# EAGLE design ATEM GPI-Tally Breakout Board (EAGLE 6.2)
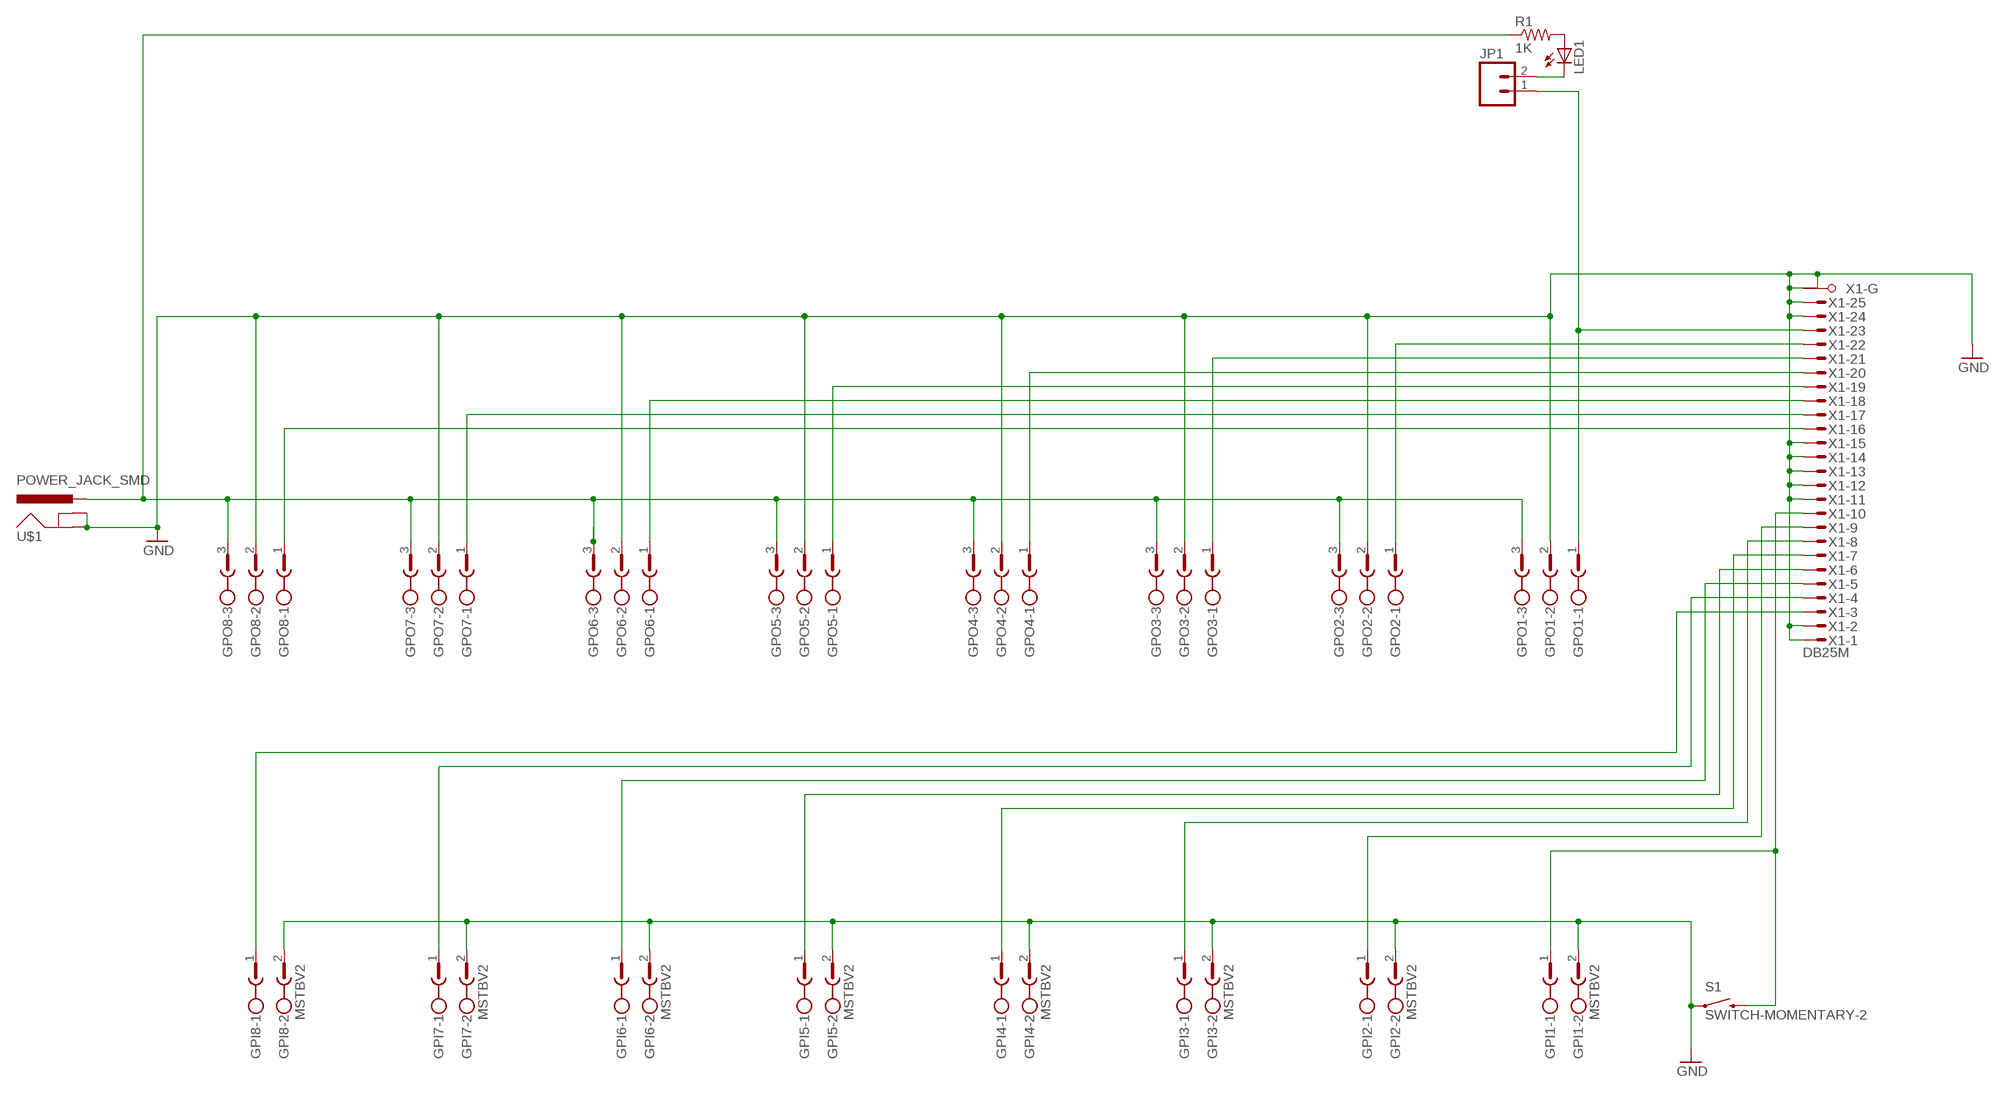
[diagram p0: schematic, sheet 1]

## Parts
GPI1  MSTBV2  [MSTBV2]
GPI2  MSTBV2  [MSTBV2]
GPI3  MSTBV2  [MSTBV2]
GPI4  MSTBV2  [MSTBV2]
GPI5  MSTBV2  [MSTBV2]
GPI6  MSTBV2  [MSTBV2]
GPI7  MSTBV2  [MSTBV2]
GPI8  MSTBV2  [MSTBV2]
GPO1  CON1  MSTBV3  [MSTBV3]
GPO2  CON1  MSTBV3  [MSTBV3]
GPO3  CON1  MSTBV3  [MSTBV3]
GPO4  CON1  MSTBV3  [MSTBV3]
GPO5  CON1  MSTBV3  [MSTBV3]
GPO6  CON1  MSTBV3  [MSTBV3]
GPO7  CON1  MSTBV3  [MSTBV3]
GPO8  CON1  MSTBV3  [MSTBV3]
JP1  M02LOCK  [1X02_LOCK]
LED1  LED5MM  [LED5MM]
R1  1K  RESISTORPTH-1/4W  [AXIAL-0.4]
S1  SWITCH-MOMENTARY-2  [TACTILE_SWITCH_TALL]
U$1  POWER_JACK_SMD  [POWER_JACK_SMD]
X1  DB25M  M25HPS  [M25HP]

## Nets
GND [PWR]: GPI1.2 GPI2.2 GPI3.2 GPI4.2 GPI5.2 GPI6.2 GPI7.2 GPI8.2 GPO1.2 GPO2.2 GPO3.2 GPO4.2 GPO5.2 GPO6.2 GPO7.2 GPO8.2 S1.A2 U$1.GND U$1.SHUNT(GNDBREAK) X1.1(-1:M) X1.2(-2:M) X1.11(-11:M) X1.12(-12:M) X1.13(-13:M) X1.14(-14:M) X1.15(-15:M) X1.24(-24:M) X1.25(-25:M) X1.G1(-G:G1) X1.G2(-G:G2)
N$1 [RELAY LINES]: GPO1.1 JP1.1 X1.23(-23:M)
N$2: JP1.2 LED1.K(C)
N$3: LED1.A R1.P$2
N$6 [RELAY LINES]: GPO2.1 X1.22(-22:M)
N$10 [RELAY LINES]: GPO3.1 X1.21(-21:M)
N$14 [RELAY LINES]: GPO4.1 X1.20(-20:M)
N$18 [RELAY LINES]: GPO5.1 X1.19(-19:M)
N$22 [RELAY LINES]: GPO6.1 X1.18(-18:M)
N$26 [RELAY LINES]: GPO7.1 X1.17(-17:M)
N$30 [RELAY LINES]: GPO8.1 X1.16(-16:M)
N$49 [INput lines]: GPI1.1 S1.B2 X1.10(-10:M)
N$55 [INput lines]: GPI5.1 X1.6(-6:M)
N$60 [INput lines]: GPI2.1 X1.9(-9:M)
N$61 [INput lines]: GPI3.1 X1.8(-8:M)
N$62 [INput lines]: GPI4.1 X1.7(-7:M)
N$64 [INput lines]: GPI6.1 X1.5(-5:M)
N$65 [INput lines]: GPI7.1 X1.4(-4:M)
N$66 [INput lines]: GPI8.1 X1.3(-3:M)
N$75 [RELAY LINES]: GPO1.3 GPO2.3 GPO3.3 GPO4.3 GPO5.3 GPO6.3 GPO7.3 GPO8.3 R1.P$1 U$1.PWR

## Library data of the parts
GPI1-GPI8 = con-phoenix-508:MSTBV2: PHOENIX; MPN: MSTBV 2,5/2-GF-5.08; OC_FARNELL: 1792792; OC_NEWARK: 69R9845
GPO1-GPO8 = con-phoenix-508:MSTBV3: PHOENIX; MPN: MSTBV 2,5/3-GF-5.08; OC_FARNELL: 1792793; OC_NEWARK: 69R9846
JP1 = SparkFun:M02: Header 2 Standard 2-pin 0.1" header. Use with straight break away headers (SKU : PRT-00116), right angle break away headers (PRT-00553), swiss pins (PRT-00743), machine pins (PRT-00117), and female headers (PRT-00115). Molex polarized connector foot print use with SKU : PRT-08233 with associated crimp pins and housings.
LED1 = SparkFun:LED: LEDs Standard schematic elements and footprints for 5mm, 3mm, 1206, and 0603 sized LEDs. 5mm - Spark Fun Electronics SKU : COM-00529 (and others)
R1 = SparkFun:RESISTOR: Resistor Basic schematic elements and footprints for 0603, 1206, and PTH resistors.
S1 = SparkFun:SWITCH-MOMENTARY-2
U$1 = SKAARHOJ:POWER_JACK_SMD: RASM712PX Right Angle SMT Mount DC Power Jack, pin size 0.100"(2.5mm), with locating post Switchcraft.com
X1 = con-subd:M25HPS: SUB-D; OC_FARNELL: unknown; OC_NEWARK: unknown

## Net classes
0 default: width 0.254 mm, drill 0.406 mm, clearance 0.254 mm
1 PWR: width 0.813 mm, drill 0.61 mm, clearance 0.254 mm
2 RELAY LINES: width 0.813 mm, drill 0.61 mm, clearance 0.254 mm
3 INput lines: width 0.254 mm, drill 0.406 mm, clearance 0.254 mm

## Board
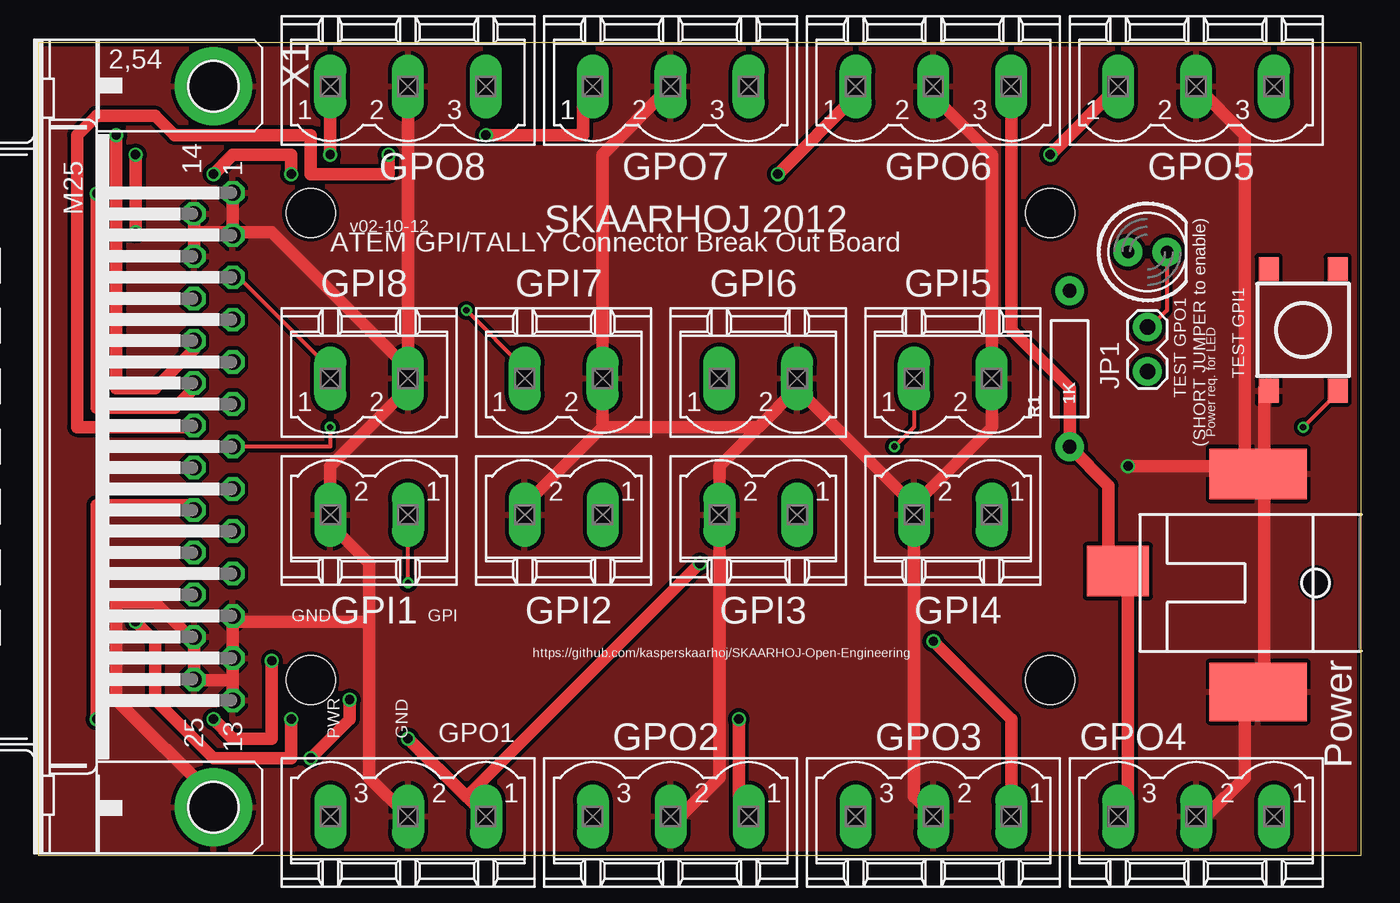
[diagram p1: board, top side]
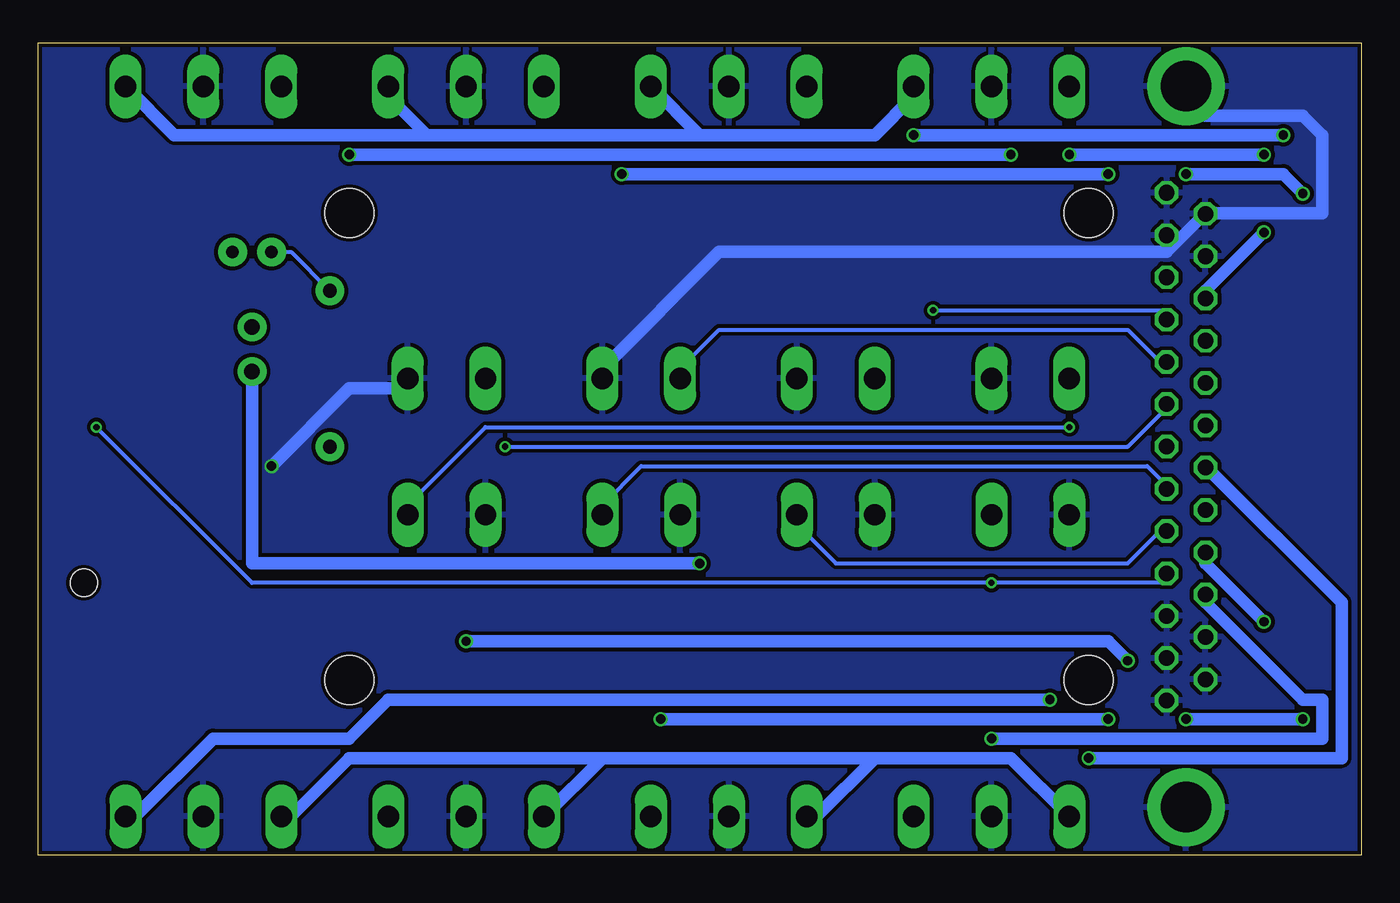
[diagram p2: board, bottom side, seen from below]

Size 86.34 x 53.01 mm. Coordinates in mm from the lower left corner, seen from the top.
Outline: 0,0 86.34,0 86.34,53.01 0,53.01 0,0
Copper layers (1*16): Top 0.035mm / dielectric 1.5mm / Bottom 0.035mm
Design rules: minimum track width 6mil, minimum drill 12mil, track to track 6mil, track to pad 6mil, pad to pad 6mil, via to via 6mil, smd to smd 0mil, copper to edge 10mil, drill to drill 10mil, minimum pad ring 10mil, minimum via ring 6mil, stop-mask expansion 2mil, vias tented up to drill 100mil, thermal gap 10mil
Holes 3.2 mm at 17.78,41.91 17.78,11.43 66.04,11.43 66.04,41.91

### Footprints (pad centres in the part's own frame; a part is rotated, then mirrored left to right if it is on the bottom)
MSTBV2 = drill 1.397 long: 1 -2.54,0; 2 2.54,0
MSTBV3 = drill 1.397 long: 1 -5.08,0; 2 0,0; 3 5.08,0
1X02_LOCK = drill 1.016 pad 1.88: 1 -0.178,0; 2 2.718,0
LED5MM = drill 0.813 pad 1.88: A -1.27,0; K 1.27,0
AXIAL-0.4 = drill 0.9 pad 1.88: P$1 -5.08,0; P$2 5.08,0
TACTILE_SWITCH_TALL = smd 1.55 x 1.3: A1 -3.975,-2.25; A2 3.975,-2.25; B1 -3.975,2.25; B2 3.975,2.25
POWER_JACK_SMD = smd 6.35 x 3.81: GND -6.756,-7.112 | smd 4.064 x 3.302: PWR -15.9,0.762 | smd 6.35 x 3.302: SHUNT -6.756,7.112 | hole 1.778: -2.997,0
M25HP = drill 1.016 octagon: 1 -16.561,1.27; 2 -13.792,1.27; 3 -11.049,1.27; 4 -8.28,1.27; 5 -5.512,1.27; 6 -2.769,1.27; 7 0,1.27; 8 2.769,1.27; 9 5.512,1.27; 10 8.28,1.27; 11 11.049,1.27; 12 13.792,1.27; 13 16.561,1.27; 14 -15.189,-1.27; 15 -12.421,-1.27; 16 -9.652,-1.27; 17 -6.909,-1.27; 18 -4.14,-1.27; 19 -1.372,-1.27; 20 1.372,-1.27; 21 4.14,-1.27; 22 6.909,-1.27; 23 9.652,-1.27; 24 12.421,-1.27; 25 15.189,-1.27 | drill 3.302 pad 5.08: G1 -23.52,0; G2 23.52,0

### Placement (x,y rotation side)
GPI1  21.59,22.23 180 top
GPI2  34.29,22.23 180 top
GPI3  46.99,22.23 180 top
GPI4  59.69,22.23 180 top
GPI5  59.69,31.11 0 top
GPI6  46.99,31.11 0 top
GPI7  34.29,31.11 0 top
GPI8  21.59,31.11 0 top
GPO1  24.13,2.54 180 top
GPO2  41.27,2.54 180 top
GPO3  58.42,2.54 180 top
GPO4  75.56,2.54 180 top
GPO5  75.56,50.16 0 top
GPO6  58.42,50.16 0 top
GPO7  41.27,50.16 0 top
GPO8  24.13,50.16 0 top
JP1  72.39,31.75 90 top
LED1  72.39,39.37 0 top
R1  67.31,31.75 90 top
S1  82.55,34.29 270 top
U$1  86.36,17.78 0 top
X1  11.43,26.67 270 top

### Tracks (layer width: path | path; a pad name or v marks a point on that pad's centre or on a via)
GND  (via drill 0.61)
  Top 0.813: 10.16,13.97 X1.25 10.16,11.43 12.7,11.43 | 12.7,11.43 12.7,12.7 X1.12 12.7,15.24 | 12.7,11.43 X1.13 | 10.16,40.64 X1.14 10.16,41.91 | 10.16,40.64 X1.15 | 10.16,40.64 12.7,40.64 | 12.7,40.64 X1.1 | GPO1.2 21.59,5.08 21.59,15.24 | 21.59,15.24 21.59,19.05 19.05,21.59 GPI1.2 19.05,25.4 24.13,30.48 GPI8.2 24.13,31.75 | 24.13,31.75 GPO8.2 | 12.7,40.64 15.24,40.64 24.13,31.75 | 12.7,40.64 X1.2 | 21.59,15.24 12.7,15.24 | 12.7,15.24 X1.11 | 10.16,13.97 7.62,16.51 5.08,16.51 5.08,10.16 11.43,3.81 X1.G2 | 10.16,13.97 X1.24 | GPO4.2 76.2,2.54 78.74,5.08 78.74,10.16 U$1.GND 80.01,11.43 80.01,24.13 U$1.SHUNT | S1.A2 80.01,30.48 80.01,25.4 U$1.SHUNT | GPO5.2 78.74,46.99 78.74,25.4 | 36.83,27.94 31.75,22.86 GPI2.2 | 36.83,27.94 GPI7.2 36.83,45.72 GPO7.2 | GPO2.2 41.91,2.54 44.45,5.08 GPI3.2 44.45,25.4 46.99,27.94 | 46.99,27.94 49.53,30.48 | 57.15,22.86 62.23,27.94 GPI5.2 62.23,45.72 58.42,49.53 GPO6.2 | GPO3.2 57.15,3.81 GPI4.2 57.15,22.86 | 57.15,22.86 49.53,30.48 | 49.53,30.48 GPI6.2 | 46.99,27.94 36.83,27.94 | v71.12,25.4 78.74,25.4 | 78.74,25.4 U$1.SHUNT
  Bottom 0.813: 10.16,41.91 2.54,41.91 2.54,46.99 3.81,48.26 10.16,48.26 11.43,49.53 X1.G1 | v71.12,25.4 66.04,30.48 62.23,30.48 GPI5.2 | 10.16,41.91 12.7,39.37 41.91,39.37 49.53,31.75 GPI6.2 | 10.16,41.91 X1.14
  pour Top: 0,0 0,53.34 86.36,53.34 86.36,0
  pour Bottom: 0,0 0,53.34 86.36,53.34 86.36,0
N$1  (via drill 0.61)
  Top 0.813: GPO1.1 27.94,3.81 | 27.94,3.81 v24.13,7.62 | 27.94,3.81 v43.18,19.05
  Bottom 0.813: v24.13,7.62 2.54,7.62 2.54,10.16 3.81,10.16 10.16,16.51 X1.23 | v43.18,19.05 72.39,19.05 JP1.1 72.39,31.75
N$2
  Top 0.254: LED1.K 73.66,35.56 72.39,34.29 JP1.2
N$3
  Bottom 0.254: R1.P$2 69.85,39.37 LED1.A
N$6  (via drill 0.61)
  Top 0.813: v6.35,15.24 7.62,13.97 7.62,10.16 11.43,6.35 16.51,6.35 v16.51,8.89 | v45.72,8.89 45.72,2.54 GPO2.1
  Bottom 0.813: v6.35,15.24 10.16,19.05 X1.22 | v45.72,8.89 v16.51,8.89
N$10  (via drill 0.61)
  Top 0.813: v3.81,8.89 3.81,22.86 10.16,22.86 X1.21 | v11.43,8.89 12.7,7.62 15.24,7.62 v15.24,12.7 | v58.42,13.97 63.5,8.89 GPO3.1
  Bottom 0.813: v11.43,8.89 v3.81,8.89 | v15.24,12.7 16.51,13.97 v58.42,13.97
N$14  (via drill 0.61)
  Top 0.813: v17.78,6.35 20.32,8.89 v20.32,10.16
  Bottom 0.813: v17.78,6.35 1.27,6.35 1.27,16.51 10.16,25.4 X1.20 | v20.32,10.16 63.5,10.16 66.04,7.62 74.93,7.62 80.01,2.54 GPO4.1
N$18  (via drill 0.61)
  Top 0.813: v22.86,45.72 22.86,44.45 17.78,44.45 17.78,46.99 8.89,46.99 7.62,48.26 3.81,48.26 2.54,46.99 2.54,27.94 10.16,27.94 X1.19 | GPO5.1 v66.04,45.72
  Bottom 0.813: v66.04,45.72 v22.86,45.72
N$22  (via drill 0.61)
  Top 0.813: v3.81,43.18 3.81,29.21 8.89,29.21 10.16,30.48 X1.18 | v11.43,44.45 12.7,45.72 16.51,45.72 v16.51,44.45 | v48.26,44.45 53.34,49.53 GPO6.1
  Bottom 0.813: v3.81,43.18 5.08,44.45 v11.43,44.45 | v48.26,44.45 v16.51,44.45
N$26  (via drill 0.61)
  Top 0.813: v5.08,46.99 5.08,30.48 7.62,30.48 10.16,33.02 X1.17 | v29.21,46.99 35.56,46.99 35.56,49.53 GPO7.1
  Bottom 0.813: v29.21,46.99 v5.08,46.99
N$30  (via drill 0.61)
  Top 0.813: v6.35,45.72 v6.35,40.64 | GPO8.1 v19.05,45.72
  Bottom 0.813: v6.35,40.64 10.16,36.83 X1.16 | v19.05,45.72 v6.35,45.72
N$49  (via drill 0.41)
  Top 0.254: v82.55,27.94 85.09,30.48 S1.B2 | v24.13,17.78 GPI1.1
  Bottom 0.254: v82.55,27.94 72.39,17.78 v24.13,17.78 12.7,17.78 X1.10
N$55  (via drill 0.41)
  Top 0.254: v55.88,26.67 57.15,27.94 GPI5.1
  Bottom 0.254: v55.88,26.67 15.24,26.67 12.7,29.21 X1.6
N$60
  Bottom 0.254: X1.9 12.7,21.59 15.24,19.05 34.29,19.05 36.83,21.59 GPI2.1
N$61
  Bottom 0.254: X1.8 12.7,24.13 13.97,25.4 46.99,25.4 49.53,22.86 GPI3.1
N$62  (via drill 0.41)
  Top 0.254: X1.7 19.05,26.67 v19.05,27.94
  Bottom 0.254: v19.05,27.94 57.15,27.94 62.23,22.86 GPI4.1
N$64
  Bottom 0.254: X1.5 12.7,31.75 15.24,34.29 41.91,34.29 44.45,31.75 GPI6.1
N$65  (via drill 0.41)
  Top 0.254: v27.94,35.56 31.75,31.75 GPI7.1
  Bottom 0.254: v27.94,35.56 12.7,35.56 X1.4
N$66
  Top 0.254: X1.3 12.7,38.1 19.05,31.75 GPI8.1
N$75
  Top 0.813: GPO4.3 71.12,2.54 71.12,17.78 U$1.PWR 69.85,19.05 69.85,24.13 R1.P$1 67.31,30.48 63.5,34.29 GPO6.3
  Bottom 0.813: 43.18,46.99 31.75,46.99 29.21,49.53 GPO8.3 | GPO7.3 43.18,46.99 | 60.96,46.99 63.5,49.53 GPO6.3 | 43.18,46.99 60.96,46.99 | GPO5.3 77.47,46.99 60.96,46.99 | GPO1.3 22.86,6.35 31.75,6.35 | 31.75,6.35 35.56,2.54 GPO2.3 | 49.53,6.35 GPO3.3 | 31.75,6.35 49.53,6.35 | 49.53,6.35 66.04,6.35 69.85,2.54 GPO4.3

### Text on the board
_tsilk: v02-10-12 | SKAARHOJ 2012 | ATEM GPI/TALLY Connector Break Out Board | TEST GPI1 | TEST GPO1 | (SHORT JUMPER to enable) | Power req. for LED | GND | GPI | https://github.com/kasperskaarhoj/SKAARHOJ-Open-Engineering | PWR | GND | Power